# Altium schematic sheet SDCARD.SchDoc
size A3; Author: HamidFijani; DrawnBy: HamidFijani; SheetNumber: 7; SheetTotal: 13
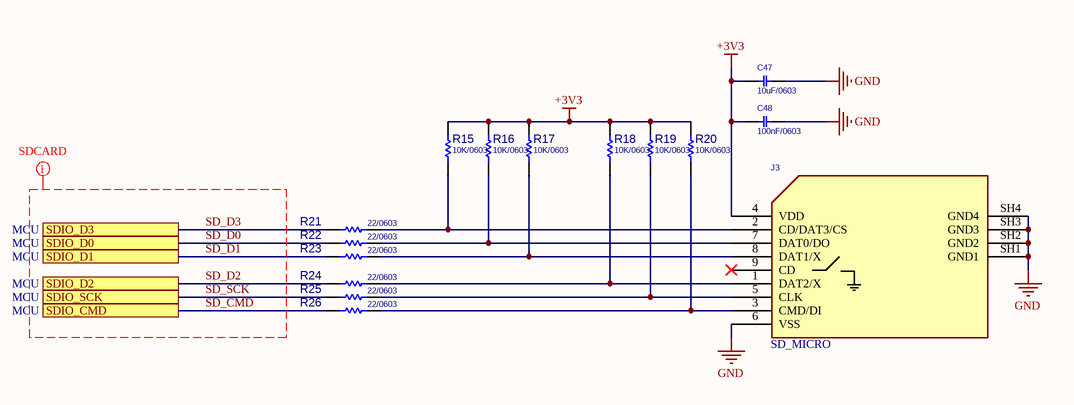
[diagram p0: SDCARD.SchDoc]

## Parts
?  (no value)  (graphical)
C47  10uF/0603  [C0603]
C48  100nF/0603  [C0603]
J3  SD_MICRO  [SDMICRO_AT]
R15  10K/0603  [R0603]
R16  10K/0603  [R0603]
R17  10K/0603  [R0603]
R18  10K/0603  [R0603]
R19  10K/0603  [R0603]
R20  10K/0603  [R0603]
R21  22/0603  [R0603]
R22  22/0603  [R0603]
R23  22/0603  [R0603]
R24  22/0603  [R0603]
R25  22/0603  [R0603]
R26  22/0603  [R0603]

## Ports
SDIO_CMD (see MCU), SDIO_D0 (see MCU), SDIO_D1 (see MCU), SDIO_D2 (see MCU), SDIO_D3 (see MCU), SDIO_SCK (see MCU)

## Nets
+3V3: C47.1 C48.1 J3.4(VDD) R15.1 R16.1 R17.1 R18.1 R19.1 R20.1
GND: C47.2 C48.2 J3.6(VSS) J3.SH1(GND1) J3.SH2(GND2) J3.SH3(GND3) J3.SH4(GND4)
SD_CMD: R26.1 ; port SDIO_CMD
SD_D0: R22.1 ; port SDIO_D0
SD_D1: R23.1 ; port SDIO_D1
SD_D2: R24.1 ; port SDIO_D2
SD_D3: R21.1 ; port SDIO_D3
SD_SCK: R25.1 ; port SDIO_SCK
NetJ3_1: J3.1(DAT2/X) R18.2 R24.2
NetJ3_2: J3.2(CD/DAT3/CS) R15.2 R21.2
NetJ3_3: J3.3(CMD/DI) R20.2 R26.2
NetJ3_5: J3.5(CLK) R19.2 R25.2
NetJ3_7: J3.7(DAT0/DO) R16.2 R22.2
NetJ3_8: J3.8(DAT1/X) R17.2 R23.2

Not connected (* = marked no-connect by the designer): J3 9(CD)*

## Layout directives
net class SDCARD: SD_CMD, SD_D0, SD_D1, SD_D2, SD_D3, SD_SCK

## Notes on the sheet
- Title:
- Page Contents:
- Variant:
- Checked by
- Size:
- Date:
- DWG NO
- Sheet
- of
- Revision:

## Library data of the parts
? = SDTitleBlock
C47 C48 = CAP_SMD_MLCC_0603: CAP, MLCC, -F, -V, MATERIAL, -%, 0201; PARAM: -, -%; MANF_P#: MANF_PART#; PRICE: 100= 1$; MANF: -; PARAM2: -V; ASSEMBLY: ASSEMBLY
  C47: VALUE: 10uF/0603
  C48: VALUE: 100nF/0603
J3 = SOCKET_SDMICRO_AT: SD MICRO exist in Iran, Attend 112J-TDAR-R01; PARAM: push-push; MANF: Attend; MANF_P#: 112J-TDAR-R01; VALUE: SD_MICRO
R15-R26 = RES_SMD_0603: RESISTOR, SMD; PARAM: -W; DESC: DESCRIPTION; DIST#: MOUSER; PARAM2: 1%; MANF_P#: -; MANF: -; ASSEMBLY: ASSEMBLY; PRICE: 100= 0.5$
  R15-R20: VALUE: 10K/0603
  R21-R26: VALUE: 22/0603